# EAGLE design CameraSliderV2 (EAGLE 7.3.0)
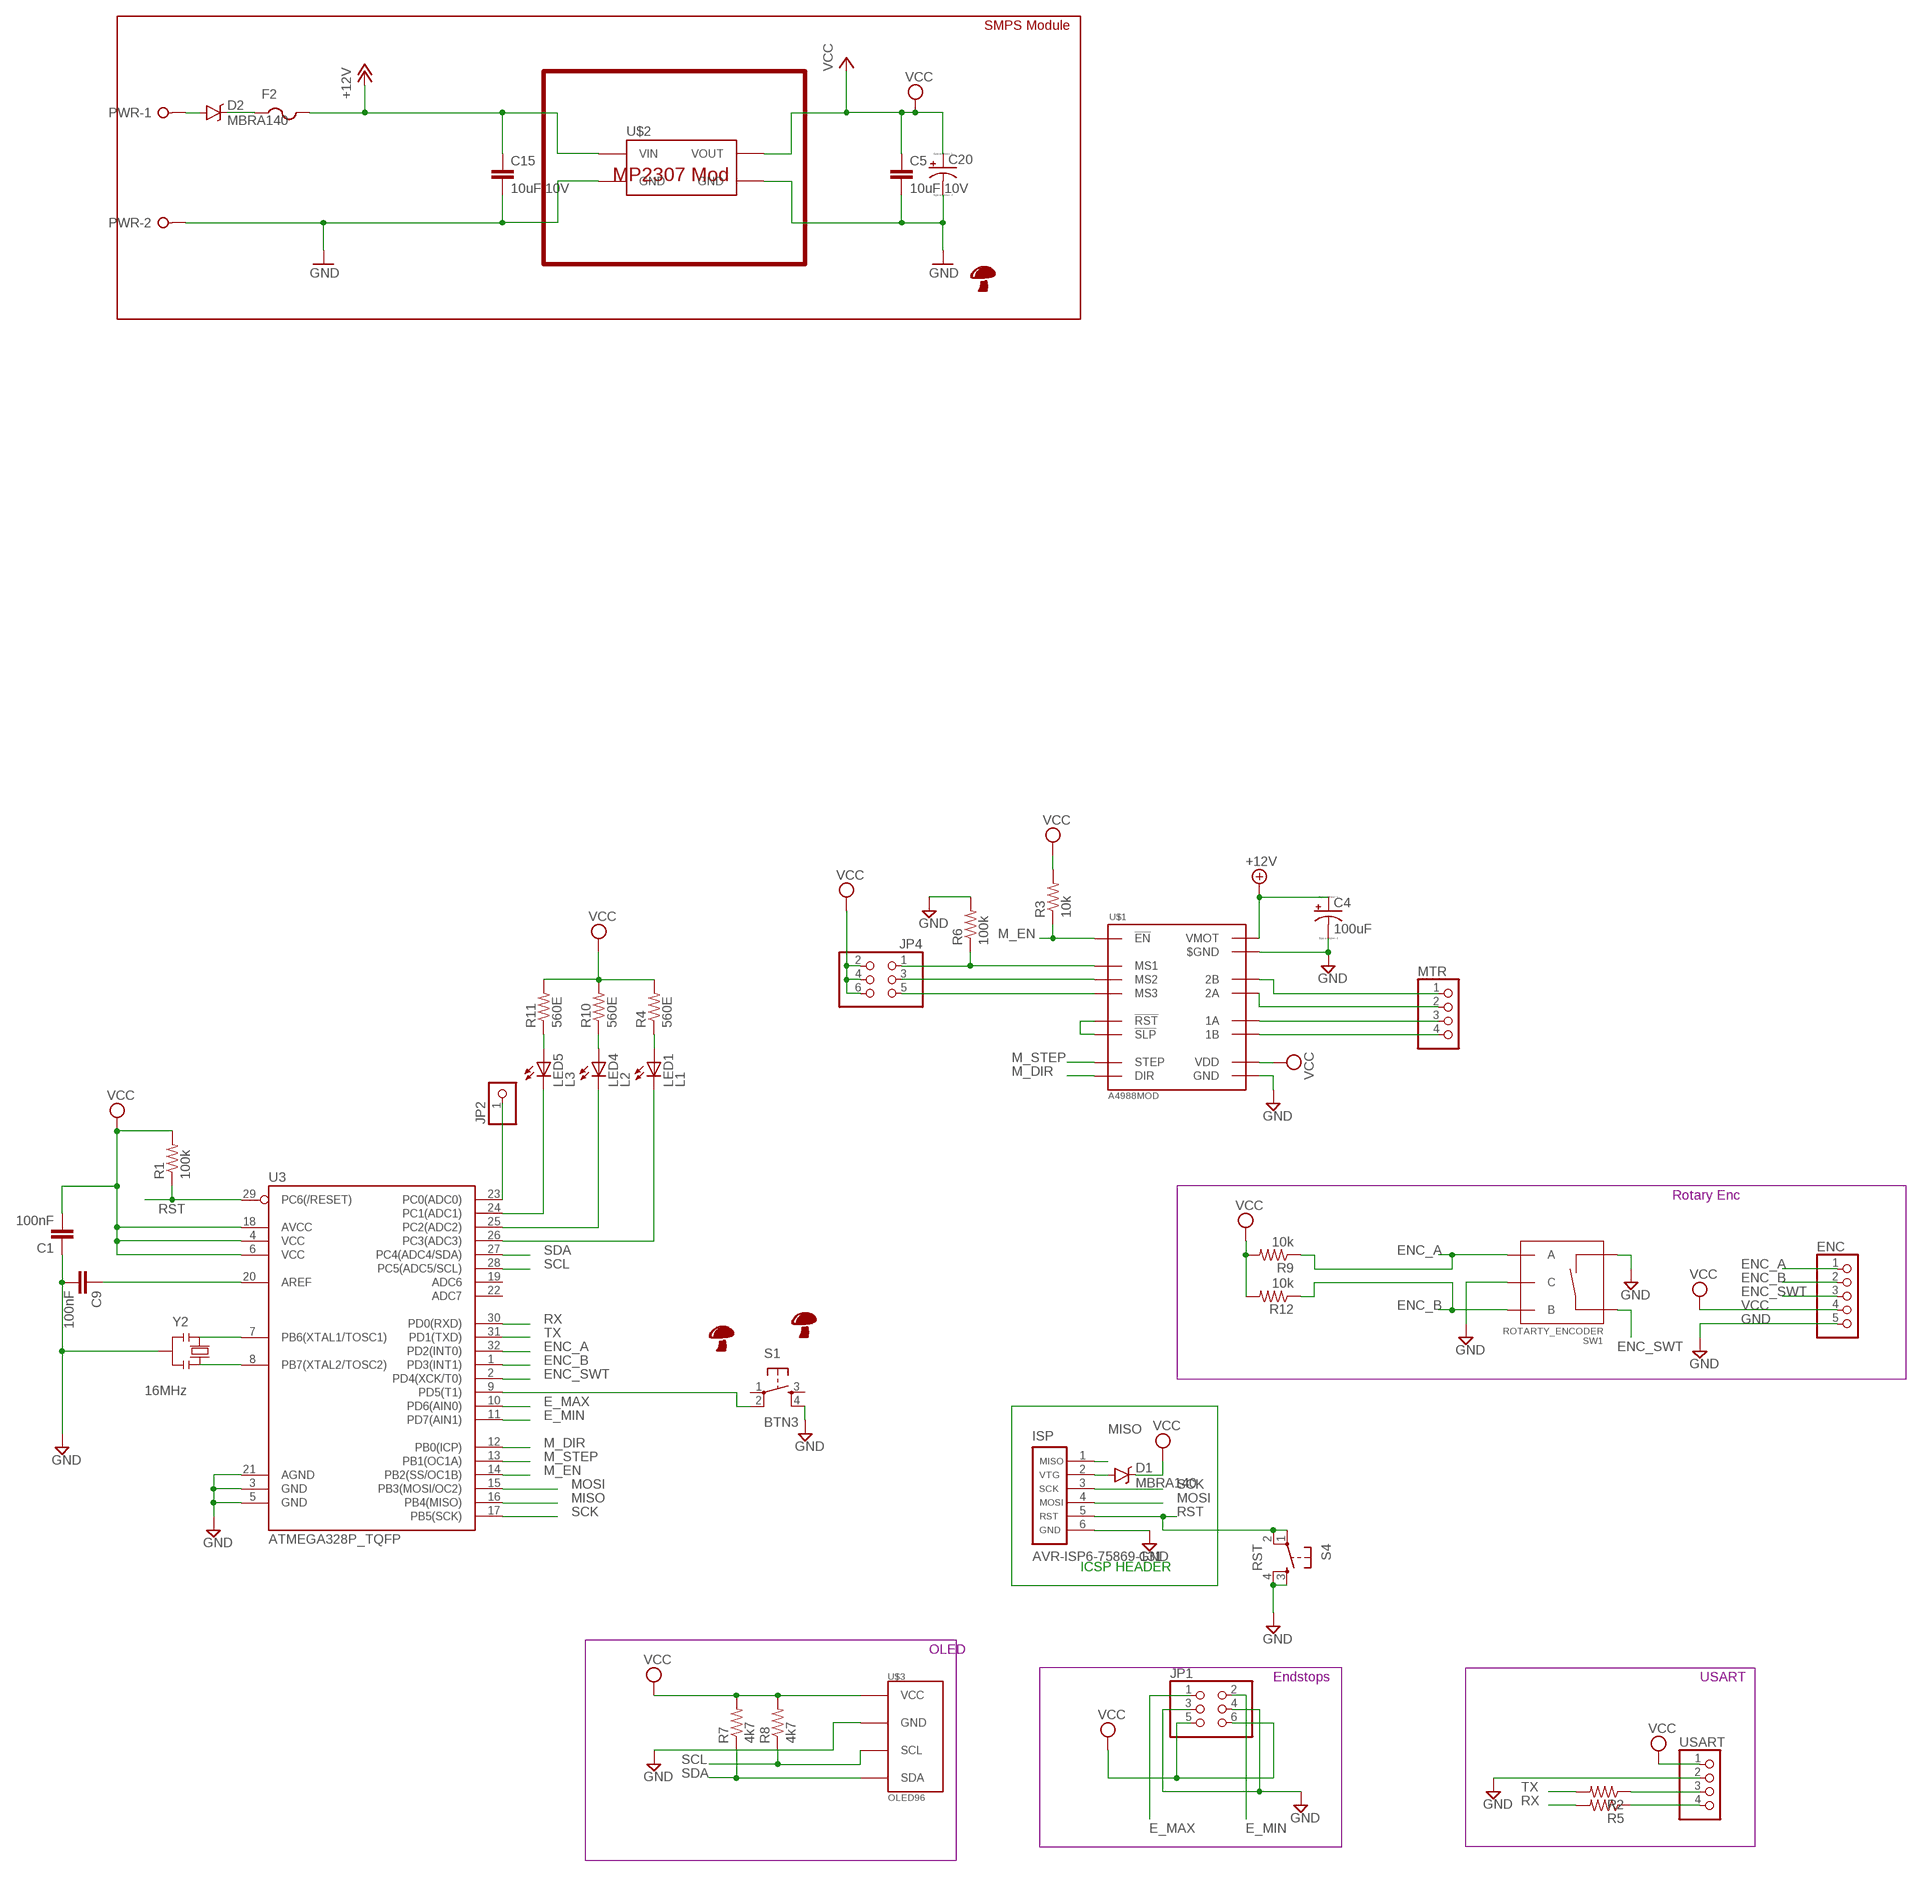
[diagram p0: schematic, sheet 1]

## Parts
C1  100nF  C-EUC0805  [C0805]
C4  100uF  CPOL-USD  [PANASONIC_D]
C5  10uF 10V  C-EUC0805  [C0805]
C9  100nF  C-EUC0805  [C0805]
C15  10uF 10V  C-EUC0805  [C0805]
C20  CPOL-USD  [PANASONIC_D]
D1  MBRA140  [SMA-DIODE]
D2  MBRA140  [SMA-DIODE]
ENC  PINHD-1X5  [1X05]
F2  PTCFUSE-1812  [1812]
ISP  AVR-ISP6-75869-131  [HDR-75869-131]
JP1  PINHD-2X3  [2X03]
JP2  PINHD-1X1  [1X01]
JP4  PINHD-2X3  [2X03]
LED1  L1  LEDCHIP-LED0805  [CHIP-LED0805]
LED4  L2  LEDCHIP-LED0805  [CHIP-LED0805]
LED5  L3  LEDCHIP-LED0805  [CHIP-LED0805]
MTR  PINHD-1X4  [1X04]
PWR  W237-02P  [W237-132]
R1  100k  R-US_M0805  [M0805]
R2  R-US_M0805  [M0805]
R3  10k  R-US_M0805  [M0805]
R4  560E  R-US_M0805  [M0805]
R5  R-US_M0805  [M0805]
R6  100k  R-US_M0805  [M0805]
R7  4k7  R-US_M0805  [M0805]
R8  4k7  R-US_M0805  [M0805]
R9  10k  R-US_M0805  [M0805]
R10  560E  R-US_M0805  [M0805]
R11  560E  R-US_M0805  [M0805]
R12  10k  R-US_M0805  [M0805]
S1  BTN3  TAC_SWITCHSMD  [TACTILE_SWITCH_SMD]
S4  RST  TAC_SWITCHSMD  [TACTILE_SWITCH_SMD]
SW1  ROTARTY_ENCODER  [ROTARY_ENC_PLAIN]
U3  ATMEGA328P_TQFP  [TQFP32-08]
U$1  A4988MOD  [A4988MOD]
U$2  MP1584_MODULE  [D-SUN_MP1584]
U$3  OLED96  [OLED96]
U$4  SHROOM10MM  [SHROOM10MM]
U$5  SHROOMTOPSILK  [SHROOM_TS]
U$15  SHROOM5MM  [SHROOM]
USART  PINHD-1X4  [1X04]
Y2  16MHz  RESONATORMU  [RESONATOR]

## Nets
+12V: C4.+ C15.1 F2.2 U$1.P$16(VMOT) U$2.P$5(VIN) U$2.P$6(VIN)
E_MAX: JP1.1 U3.10(PD6(AIN0))
E_MIN: JP1.2 U3.11(PD7(AIN1))
ENC_A: ENC.1 R9.1 SW1.A U3.32(PD2(INT0))
ENC_B: ENC.2 R12.1 SW1.B U3.1(PD3(INT1))
ENC_SWT: ENC.3 SW1.SW+ U3.2(PD4(XCK/T0))
GND: C1.1 C4.- C5.2 C9.2 C15.2 C20.- ENC.5 ISP.6 JP1.3 JP1.4 PWR.2 R6.2 S1.4 S4.3 S4.4 SW1.C SW1.SW- U3.3(GND) U3.5(GND) U3.21(AGND) U$1.P$9(GND) U$1.P$15($GND) U$2.P$1(GND) U$2.P$2(GND) U$2.P$3(GND) U$2.P$4(GND) U$3.P$2(GND) USART.2 Y2.2
M_DIR: U3.12(PB0(ICP)) U$1.P$8(DIR)
M_EN: R3.1 U3.14(PB2(SS/OC1B)) U$1.P$1(!EN)
M_STEP: U3.13(PB1(OC1A)) U$1.P$7(STEP)
MISO: ISP.1 U3.16(PB4(MISO))
MOSI: ISP.4 U3.15(PB3(MOSI/OC2))
N$1: LED1.A R4.1
N$2: D1.A ISP.2
N$3: LED5.C U3.24(PC1(ADC1))
N$4: JP4.1 R6.1 U$1.P$2(MS1)
N$5: U3.7(PB6(XTAL1/TOSC1)) Y2.1
N$6: U3.8(PB7(XTAL2/TOSC2)) Y2.3
N$7: LED4.A R10.1
N$8: LED5.A R11.1
N$9: LED4.C U3.25(PC2(ADC2))
N$10: LED1.C U3.26(PC3(ADC3))
N$11: S1.2 U3.9(PD5(T1))
N$12: MTR.2 U$1.P$13(2A)
N$13: R2.1 USART.3
N$14: R5.1 USART.4
N$15: C9.1 U3.20(AREF)
N$16: MTR.1 U$1.P$14(2B)
N$17: MTR.3 U$1.P$12(1A)
N$18: MTR.4 U$1.P$11(1B)
N$19: JP4.3 U$1.P$3(MS2)
N$20: JP4.5 U$1.P$4(MS3)
N$21: U$1.P$5(!RST) U$1.P$6(!SLP)
N$22: D2.A PWR.1
N$23: JP2.1 U3.23(PC0(ADC0))
N$32: D2.C F2.1
RST: ISP.5 R1.1 S4.1 S4.2 U3.29(PC6(/RESET))
RX: R5.2 U3.30(PD0(RXD))
SCK: ISP.3 U3.17(PB5(SCK))
SCL: R8.1 U3.28(PC5(ADC5/SCL)) U$3.P$3(SCL)
SDA: R7.1 U3.27(PC4(ADC4/SDA)) U$3.P$4(SDA)
TX: R2.2 U3.31(PD1(TXD))
VCC: C1.2 C5.1 C20.+ D1.C ENC.4 JP1.5 JP1.6 JP4.2 JP4.4 JP4.6 R1.2 R3.2 R4.2 R7.2 R8.2 R9.2 R10.2 R11.2 R12.2 U3.4(VCC) U3.6(VCC) U3.18(AVCC) U$1.P$10(VDD) U$2.P$7(VOUT) U$2.P$8(VOUT) USART.1
Unconnected: S1.1 S1.3 U3.19(ADC6) U3.22(ADC7)

## Notes on the sheet
- SMPS Module
- MP2307 Mod
- Rotary Enc
- ICSP HEADER
- OLED
- Endstops | USART

## Power pins joined to a net without a drawn wire
VCC: U$3.P$1(VCC)

## Library data of the parts
C1 C5 C9 C15 = resistor:C-EU: CAPACITOR, European symbol
C4 C20 = resistor:CPOL-US: POLARIZED CAPACITOR, American symbol
D1 D2 = SparkFun-DiscreteSemi:MBRA140: 40V, 1A Schottky rectifier SMA/DO-214AC package DIO-08053; PROD_ID: DIO-08053
ENC = pinhead:PINHD-1X5: PIN HEADER
F2 = adafruit:PTCFUSE: PTC fuses, resettable thermistors
ISP = atmel-avr:AVR-ISP6-: AVR ISP-6 Serial Programming Header
JP1 JP4 = pinhead:PINHD-2X3: PIN HEADER
JP2 = pinhead:PINHD-1X1: PIN HEADER
LED1 LED4 LED5 = led:LED: LED OSRAM: - CHIPLED LG R971, LG N971, LY N971, LG Q971, LY Q971, LO R971, LY R971 LH N974, LH R974 LS Q976, LO Q976, LY Q976 LO Q996 - Hyper CHIPLED LW Q18S LB Q993, LB Q99A, LB R99A - SideLED LS A670, LO A670, LY A670, LG A670, LP A670 LB A673, LV A673, LT A673, LW A673 LH A674 LY A675 LS A676, LA A676, LO A676, LY A676, LW A676 LS A679, LY A679, LG A679 - Hyper Micro SIDELED® LS Y876, LA Y876, LO Y876, LY Y876 LT Y87S - SmartLED LW L88C, LW L88S LB L89C, LB L89S, LG L890 LS L89K, LO L89K, LY L89K LS L896, LA L896, LO L896, LY L896 - TOPLED LS T670, LO T670, LY T670, LG T670, LP T670 LSG T670, LSP T670, LSY T670, LOP T670, LYG T670 LG T671, LOG T671, LSG T671 LB T673, LV T673, LT T673, LW T673 LH T674 LS T676, LA T676, LO T676, LY T676, LB T676, LH T676, LSB T676, LW T676 LB T67C, LV T67C, LT T67C, LS T67K, LO T67K, LY T67K, LW E67C LS E67B, LA E67B, LO E67B, LY E67B, LB E67C, LV E67C, LT E67C LW T67C LS T679, LY T679, LG T679 LS T770, LO T770, LY T770, LG T770, LP T770 LB T773, LV T773, LT T773, LW T773 LH T774 LS E675, LA E675, LY E675, LS T675 LS T776, LA T776, LO T776, LY T776, LB T776 LHGB T686 LT T68C, LB T68C - Hyper Mini TOPLED® LB M676 - Mini TOPLED Santana® LG M470 LS M47K, LO M47K, LY M47K Source: http://www.osram.convergy.de LUXEON: - LUMILED® LXK2-PW12-R00, LXK2-PW12-S00, LXK2-PW14-U00, LXK2-PW14-V00 LXK2-PM12-R00, LXK2-PM12-S00, LXK2-PM14-U00 LXK2-PE12-Q00, LXK2-PE12-R00, LXK2-PE12-S00, LXK2-PE14-T00, LXK2-PE14-U00 LXK2-PB12-K00, LXK2-PB12-L00, LXK2-PB12-M00, LXK2-PB14-N00, LXK2-PB14-P00, LXK2-PB14-Q00 LXK2-PR12-L00, LXK2-PR12-M00, LXK2-PR14-Q00, LXK2-PR14-R00 LXK2-PD12-Q00, LXK2-PD12-R00, LXK2-PD12-S00 LXK2-PH12-R00, LXK2-PH12-S00 LXK2-PL12-P00, LXK2-PL12-Q00, LXK2-PL12-R00 Source: www.luxeon.com KINGBRIGHT: KA-3528ASYC Source: www.kingbright.com
MTR USART = pinhead:PINHD-1X4: PIN HEADER
PWR = con-wago-508:W237-02P: WAGO SREW CLAMP; OC_FARNELL: unknown; OC_NEWARK: unknown
R1-R12 = resistor:R-US_: RESISTOR, American symbol
S1 S4 = SparkFun:TAC_SWITCH: Momentary Switch Button commonly used for reset or general input. Spark Fun Electronics SKU : COM-00097
SW1 = SparkFun-Electromechanical:ROTARTY_ENCODER: Simple no LED rotary encoder Example: COM-09117
U3 = SparkFun-DigitalIC:ATMEGA328P_TQFP; PROD_ID: IC-09069
U$1 = RobThePyro:A4988MOD
U$2 = RobThePyro:MP1584_MODULE: SMPS Module D-SUN MP1584 http://www.haoyuelectronics.com/Attachment/MP1584/MP1584_3.jpg
U$3 = RobThePyro:OLED96: OLED Module 0.96' 128x64 I2C
U$4 U$5 U$15 = RobThePyro:SHROOM
Y2 = SmartPrj:RESONATOR

## Board
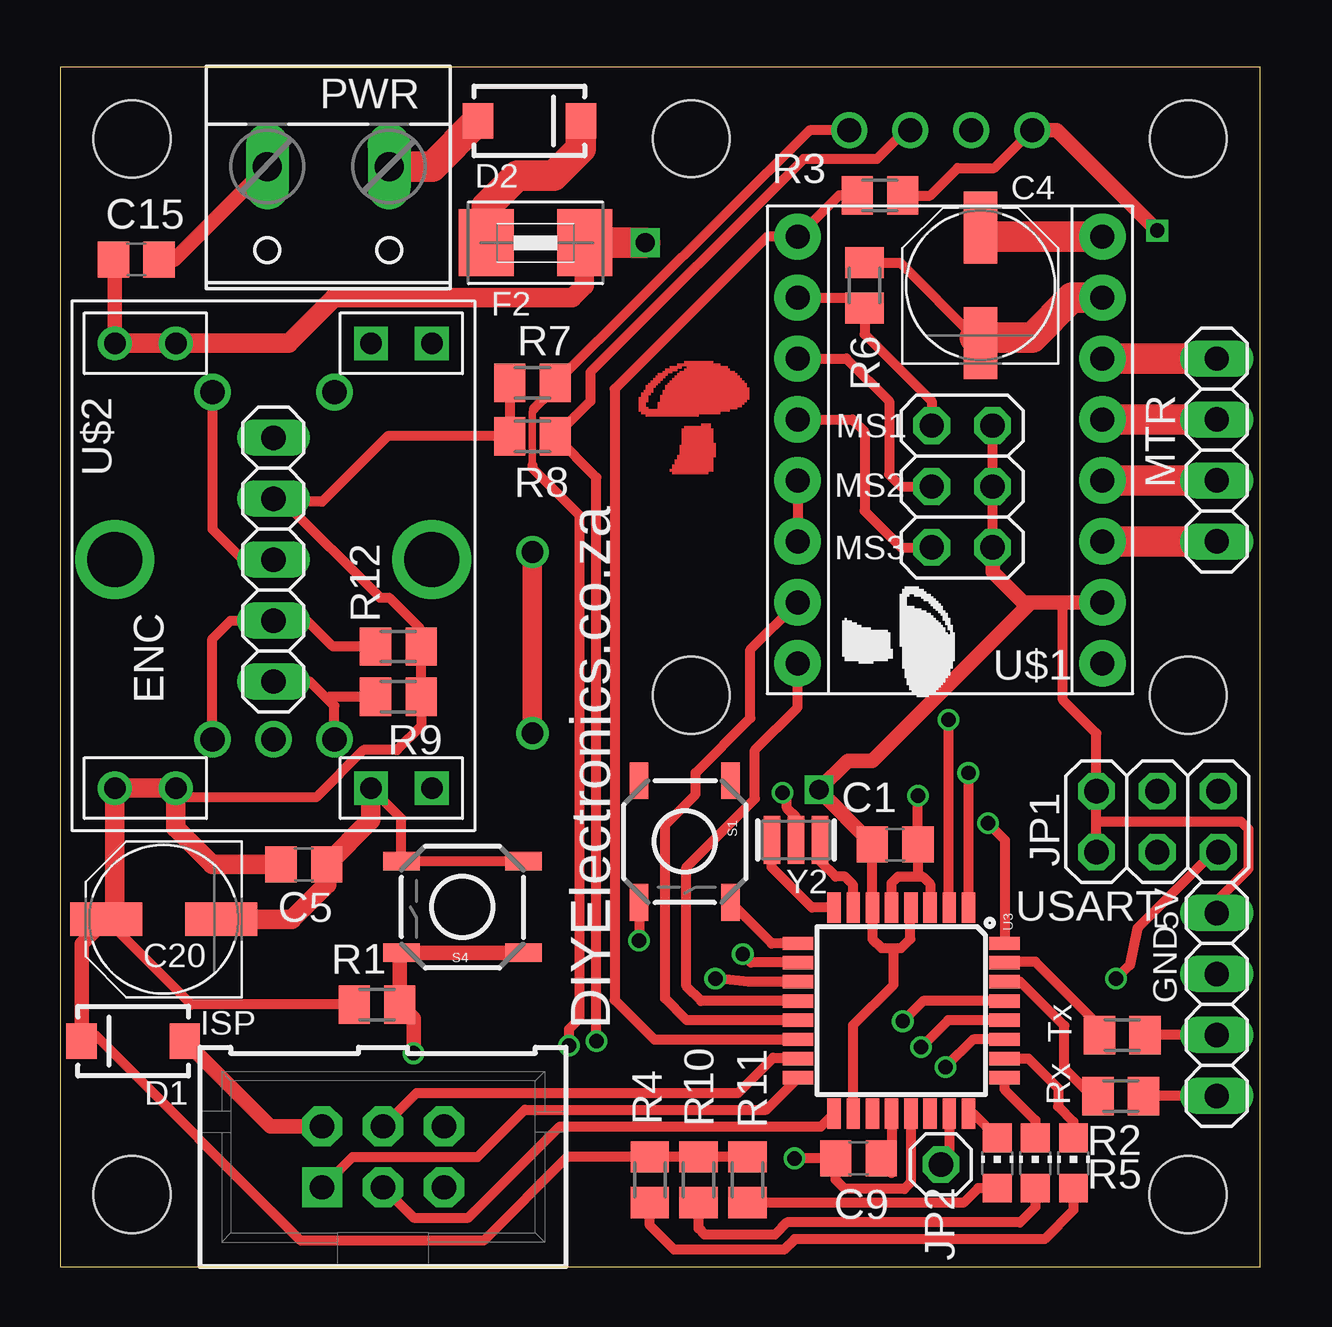
[diagram p1: board, top side]
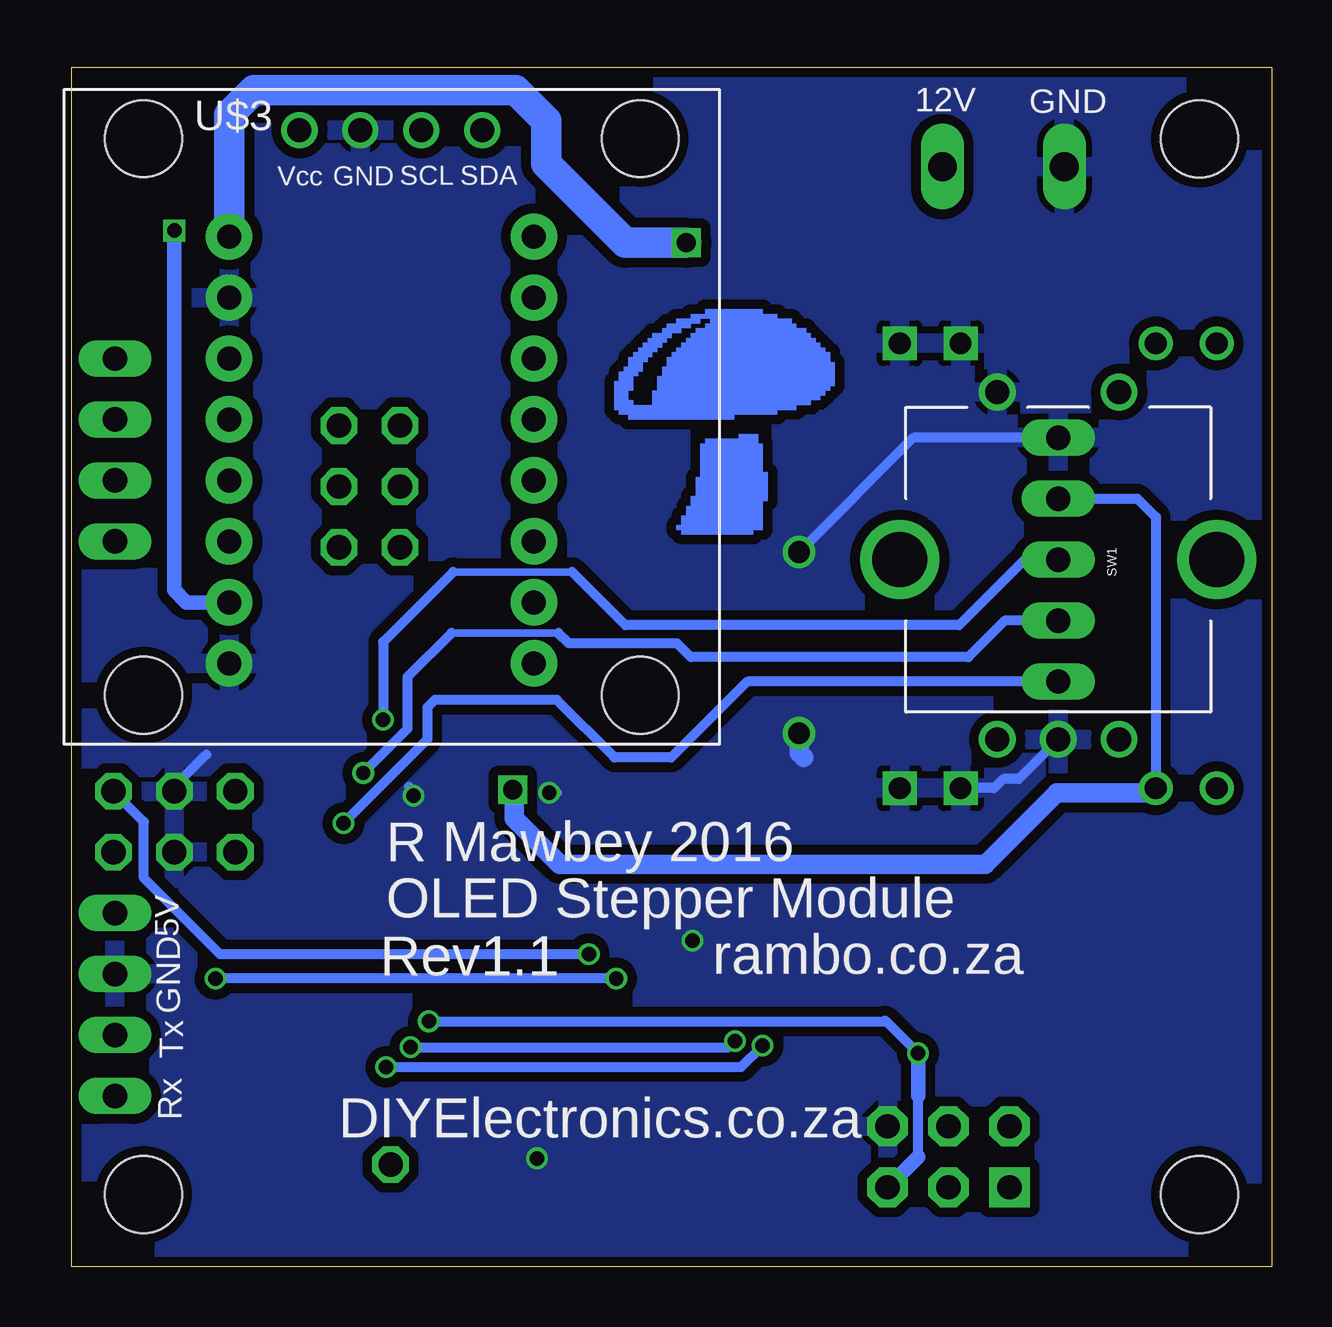
[diagram p2: board, bottom side, seen from below]

Size 50 x 50 mm. Coordinates in mm from the lower left corner, seen from the top.
Outline: 0,0 50,0 50,50 0,50 0,0
Copper layers (1*16): Top 0.035mm / dielectric 1.5mm / Bottom 0.035mm
Design rules "dirt_cheap_dirty_boards.v1": minimum track width 5mil, minimum drill 12mil, track to track 5mil, track to pad 5mil, pad to pad 5mil, via to via 5mil, smd to smd 0mil, copper to edge 10mil, drill to drill 10mil, minimum pad ring 10mil, minimum via ring 6mil, stop-mask expansion 2mil, vias tented up to drill 25mil, thermal gap 10mil
Holes 3.2 mm at 3,3 3,47 47,3

### Footprints (pad centres in the part's own frame; a part is rotated, then mirrored left to right if it is on the bottom)
C0805 = smd 1.3 x 1.5: 1 -0.95,0; 2 0.95,0
PANASONIC_D = smd 3 x 1.4: + 2.4,0; - -2.4,0
SMA-DIODE = smd 1.27 x 1.47: A -2.15,0; C 2.15,0
1X05 = drill 1.016 long: 1 -5.08,0; 2 -2.54,0; 3 0,0; 4 2.54,0; 5 5.08,0
1812 = smd 2.286 x 2.794: 1 -2.046,0; 2 2.046,0
HDR-75869-131 = drill 1.016 pad 1.676 square: 1 -2.54,-1.27 | drill 1.016 pad 1.676 octagon: 2 -2.54,1.27; 3 0,-1.27; 4 0,1.27; 5 2.54,-1.27; 6 2.54,1.27
2X03 = drill 1.016 octagon: 1 -2.54,-1.27; 2 -2.54,1.27; 3 0,-1.27; 4 0,1.27; 5 2.54,-1.27; 6 2.54,1.27
1X01 = drill 1.016 octagon: 1 0,0
CHIP-LED0805 = smd 1.2 x 1.2: A 0,-1.05; C 0,1.05
1X04 = drill 1.016 long: 1 -3.81,0; 2 -1.27,0; 3 1.27,0; 4 3.81,0
W237-132 = drill 1.194 long: 1 -2.54,-0.635; 2 2.54,-0.635
M0805 = smd 1.3 x 1.6: 1 -0.95,0; 2 0.95,0
TACTILE_SWITCH_SMD = smd 1.524 x 0.762: 1 -2.54,1.905; 2 2.54,1.905; 3 -2.54,-1.905; 4 2.54,-1.905
ROTARY_ENC_PLAIN = drill 1.016: A 7.493,-2.54; B 7.493,2.54; C 7.493,0; SW+ -6.985,2.54; SW- -6.985,-2.54 | drill 2.286: P$3 0,6.604; P$4 0,-6.604
TQFP32-08 = smd 1.27 x 0.559: 1 -4.293,2.8; 2 -4.293,2; 3 -4.293,1.2; 4 -4.293,0.4; 5 -4.293,-0.4; 6 -4.293,-1.2; 7 -4.293,-2; 8 -4.293,-2.8; 17 4.293,-2.8; 18 4.293,-2; 19 4.293,-1.2; 20 4.293,-0.4; 21 4.293,0.4; 22 4.293,1.2; 23 4.293,2; 24 4.293,2.8 | smd 0.559 x 1.27: 9 -2.8,-4.293; 10 -2,-4.293; 11 -1.2,-4.293; 12 -0.4,-4.293; 13 0.4,-4.293; 14 1.2,-4.293; 15 2,-4.293; 16 2.8,-4.293; 25 2.8,4.293; 26 2,4.293; 27 1.2,4.293; 28 0.4,4.293; 29 -0.4,4.293; 30 -1.2,4.293; 31 -2,4.293; 32 -2.8,4.293
A4988MOD = drill 1 pad 1.93: P$1 -6.35,8.89; P$2 -6.35,6.35; P$3 -6.35,3.81; P$4 -6.35,1.27; P$5 -6.35,-1.27; P$6 -6.35,-3.81; P$7 -6.35,-6.35; P$8 -6.35,-8.89; P$9 6.35,-8.89; P$10 6.35,-6.35; P$11 6.35,-3.81; P$12 6.35,-1.27; P$13 6.35,1.27; P$14 6.35,3.81; P$15 6.35,6.35; P$16 6.35,8.89
D-SUN_MP1584 = drill 0.9 square: P$1 -9.271,6.604; P$2 -9.271,4.064; P$3 9.271,6.604; P$4 9.271,4.064 | drill 0.9: P$5 -9.271,-6.604; P$6 -9.271,-4.064; P$7 9.271,-6.604; P$8 9.271,-4.064
OLED96 = drill 1: P$1 -3.85,11.95; P$2 -1.31,11.95; P$3 1.23,11.95; P$4 3.77,11.95 | hole 3.2: -10.35,-11.6; -10.35,11.6; 10.35,11.6; 10.35,-11.6
RESONATOR = smd 0.7 x 2: 1 -1,0; 2 0,0; 3 1,0

### Placement (x,y rotation side)
C1  34.8,17.59 180 top
C4  38.35,40.89 90 top
C5  10.16,16.76 0 top
C9  33.27,4.51 180 top
C15  3.17,41.97 0 top
C20  4.32,14.48 180 top
D1  3.05,9.4 180 top
D2  19.56,47.75 0 top
ENC  8.89,29.46 90 top
F2  19.81,42.67 0 top
ISP  13.46,4.57 0 top
JP1  45.72,18.54 180 top
JP2  36.7,4.25 0 top
JP4  37.59,32.51 270 top
LED1  42.23,4.32 0 top
LED4  40.64,4.32 0 top
LED5  39.05,4.32 0 top
MTR  48.2,34.04 270 top
PWR  11.18,45.21 180 top
R1  13.21,10.92 180 top
R2  44.26,9.65 180 top
R3  34.16,44.64 0 top
R4  24.57,3.62 90 top
R5  44.2,7.11 180 top
R6  33.53,40.89 90 top
R7  19.68,36.83 180 top
R8  19.68,34.61 180 top
R9  14.1,23.75 0 top
R10  26.61,3.62 90 top
R11  28.64,3.62 90 top
R12  14.1,25.84 0 top
S1  26.04,17.72 270 top
S4  16.76,14.99 180 top
SW1  8.89,29.46 270 bottom
U3  35.05,10.67 270 top
U$1  37.08,34.04 0 top
U$2  8.89,29.21 270 top
U$3  36.66,35.41 0 bottom
U$4  27.5,30.61 0 bottom
U$5  32.64,28.38 270 top
U$15  24.07,33.08 0 top
USART  48.2,10.92 270 top
Y2  30.67,17.78 180 top

### Tracks (layer width: path | path; a pad name or v marks a point on that pad's centre or on a via)
+12V  (via drill 0.8)
  Top 0.61: U$2.P$5 2.29,41.91 C15.1
  Top 0.813: U$2.P$5 U$2.P$6 9.53,38.48 11.43,40.39 21.34,40.39 21.84,40.89 21.84,42.66 F2.2
  Top 1.27: U$1.P$16 38.72,42.93 C4.+ | F2.2 v24.38,42.67
  Bottom 1.27: v24.38,42.67 26.92,42.67 30.23,45.97 30.23,47.75 31.5,49.02 42.42,49.02 43.43,48.01 U$1.P$16
E_MAX  (via drill 0.6)
  Top 0.406: U3.10 28.8,12.67 v28.45,13.02
  Bottom 0.406: v28.45,13.02 43.81,13.02 46.99,16.19 46.99,18.54 JP1.1
E_MIN  (via drill 0.6)
  Top 0.406: U3.11 28.7,11.87 v27.3,12 | JP1.2 48.07,17.27 44.9,14.1 44.58,12.57 v44.01,12
  Bottom 0.406: v27.3,12 v44.01,12
ENC_A  (via drill 0.6)
  Top 0.406: SW1.A 11.43,23.37 11.14,23.65 | 11.14,23.65 10.41,24.38 ENC.1 | R9.1 11.24,23.75 11.14,23.65 | v38.67,18.48 39.37,17.78 39.37,13.49 U3.32
  Bottom 0.406: ENC.1 21.84,24.38 25.02,21.21 27.37,21.21 29.78,23.62 34.86,23.62 35.18,23.3 35.18,21.97 v38.67,18.48
ENC_B  (via drill 0.6)
  Top 0.406: SW1.B 6.35,26.16 7.11,26.92 ENC.2 10.29,26.92 11.37,25.84 R12.1 | v37.85,20.57 U3.1
  Bottom 0.305: 29.72,26.42 34.16,26.42
  Bottom 0.406: ENC.2 11.11,26.92 12.64,25.4 24.19,25.4 24.77,25.97 29.27,25.97 29.72,26.42 | 34.16,26.42 36.01,24.57 36.01,22.42 v37.85,20.57
ENC_SWT  (via drill 0.6)
  Top 0.406: SW1.SW+ 6.35,30.73 7.62,29.46 ENC.3 | v37.02,22.8 37.02,14.99 U3.2
  Bottom 0.305: 29.15,28.96 34.1,28.96
  Bottom 0.406: ENC.3 10.29,29.46 13.02,26.73 26.92,26.73 29.15,28.96 | 34.1,28.96 37.02,26.04 v37.02,22.8
GND  (via drill 0.6, 0.9)
  Top 0.406: R6.2 35,41.84 38.12,38.73 C4.- | U3.5 34.65,15.98 34.92,16.26 35.75,16.26 | 35.75,16.26 35.94,16.26 36.26,15.94 U3.3 | 35.75,16.26 C1.1 35.75,19.36 35.75,19.37 v35.75,19.62 | U$2.P$4 14.22,18.67 S4.4 S4.3 | S1.4 v24.13,13.59 | U3.21 35.45,3.51 35.18,3.24 32.7,3.24 32.32,3.62 C9.2 | C9.2 | C9.2 v30.61,4.51 | Y2.2 30.67,18.73 30.29,19.11 30.29,19.56 v30.1,19.75
  Top 0.61: C15.2 4.76,41.97 PWR.2
  Top 0.813: U$2.P$4 12.95,18.61 C5.2 11.11,15.94 9.65,14.48 C20.- | v19.68,29.78 v19.68,22.23
  Top 1.27: 38.12,38.73 40.5,38.73 42.16,40.39 U$1.P$15
  Bottom 0.406: v35.75,19.62 35.75,19.81 35.94,20 | JP1.3 45.72,20 44.39,21.34 | v24.13,13.59 24.13,13.34 | SW1.C 10.54,20.32 11.18,20.32 11.56,19.94 U$2.P$4 | v30.1,19.75 29.78,19.75 | ENC.5 14.92,34.54 v19.68,29.78
  Bottom 0.813: v19.68,22.23 19.68,21.4 19.49,21.21
  pour Bottom (isolate 0.406): 0,0 0,50 50,50 50,0
M_DIR
  Top 0.406: U3.12 26.71,11.07 26.1,11.68 26.1,16.64 28.96,19.49 28.96,21.53 30.73,23.3 U$1.P$8
M_EN
  Top 0.406: U3.14 24.77,9.46 23.11,11.11 23.11,36.58 29.46,42.93 U$1.P$1 32.45,44.64 R3.1
M_STEP
  Top 0.406: U3.13 26.12,10.27 25.21,11.18 25.21,18.41 26.48,19.68 26.48,20.57 28.77,22.86 28.77,25.72 U$1.P$7
MISO
  Top 0.406: ISP.1 12.19,4.57 17.4,4.57 19.37,6.54 29.43,6.54 U3.16
MOSI
  Top 0.406: 30.73,8.64 U3.15 30.73,8.7 29.72,8.7 28.26,7.24 14.86,7.24 ISP.4
N$1
  Top 0.406: LED1.A 42.23,2.35 41.02,1.14 30.61,1.14 30.16,0.7 25.59,0.7 24.57,1.71 R4.1
N$2
  Top 0.61: ISP.2 8.75,5.84 D1.A
N$3
  Top 0.406: U3.24 38.05,6.38 LED5.C
N$4
  Top 0.406: U$1.P$2 33.09,40.39 | JP4.1 36.32,36.07 33.53,38.86 33.53,40.39 33.09,40.39 | 33.09,40.39 R6.1
N$5
  Top 0.406: U3.7 33.05,15.91 32.7,16.26 32.32,16.26 31.69,16.89 31.69,17.76 Y2.1
N$6
  Top 0.406: U3.8 31.33,14.96 29.65,16.64 29.65,17.76 Y2.3
N$7
  Top 0.406: LED4.A 40.64,2.48 40.01,1.84 30.29,1.84 29.78,1.33 26.86,1.33 26.61,1.59 R10.1
N$8
  Top 0.406: LED5.A 38.26,3.27 37.66,2.67 R11.1
N$9
  Top 0.406: U3.25 39.34,7.39 40.64,6.1 LED4.C
N$10
  Top 0.406: U3.26 40.35,8.67 41.59,7.43 41.59,6.67 42.23,6.03 LED1.C
N$11
  Top 0.406: U3.9 29.65,13.47 S1.2
N$12
  Top 1.27: U$1.P$13 MTR.2
N$13
  Top 0.406: USART.3 R2.1
N$14
  Top 0.406: USART.4 R5.1
N$15
  Top 0.406: U3.20 34.65,3.89 C9.1
N$16
  Top 1.27: U$1.P$14 MTR.1
N$17
  Top 1.27: U$1.P$12 MTR.3
N$18
  Top 1.27: U$1.P$11 MTR.4
N$19
  Top 0.406: U$1.P$3 32.77,37.85 34.54,36.07 34.54,33.02 35.05,32.51 JP4.3
N$20
  Top 0.406: U$1.P$4 33.02,35.31 33.53,34.8 33.53,31.5 35.05,29.97 JP4.5
N$21
  Top 0.406: U$1.P$5 U$1.P$6
N$22
  Top 1.27: PWR.1 15.5,45.85 D2.A
N$23
  Top 0.406: U3.23 37.05,4.6 JP2.1
N$32
  Top 1.27: D2.C 21.71,46.6 20.57,45.47 19.05,45.47 17.78,44.2 17.78,42.69 F2.1
RST  (via drill 0.6)
  Top 0.406: U3.29 35.96,11.07 v35.12,10.22
  Top 0.61: v14.73,8.89 14.73,10.35 R1.1 14.16,13.02 S4.2 S4.1
  Bottom 0.406: 14.73,4.57 14.73,7.11 | v14.73,8.89 16.1,10.26 16.13,10.22 v35.12,10.22
  Bottom 0.61: ISP.5 14.73,4.57 | 14.73,7.11 v14.73,8.89
RX
  Top 0.406: R5.2 42.99,7.11 41.85,8.26 41.85,10.03 40.01,11.87 U3.30
SCK
  Top 0.406: ISP.3 14.73,2.03 17.02,2.03 20.83,5.84 31.72,5.84 U3.17 32.23,6.35
SCL  (via drill 0.6)
  Top 0.406: U3.28 37,10.27 v35.88,9.14 | v22.35,9.4 22.35,32.89 R8.1 22.1,36.07 22.1,37.27 30.99,46.16 34.04,46.16 35.24,47.36 U$3.P$3
  Bottom 0.406: v35.88,9.14 22.61,9.14 v22.35,9.4
SDA  (via drill 0.6)
  Top 0.305: 19.75,35.75 19.75,35.69 19.68,35.62 19.68,33.4
  Top 0.406: U3.27 38.04,9.47 v36.89,8.32 | U$3.P$4 31.23,47.36 R7.1 20.38,36.52 20.38,36.39 19.75,35.75 | 19.68,33.4 19.68,33.27 21.65,31.3 21.65,10.35 21.21,9.91 v21.21,9.21
  Bottom 0.406: v36.89,8.32 22.1,8.32 v21.21,9.21
TX
  Top 0.406: R2.2 43.31,10.03 40.64,12.7 39.38,12.7 U3.31
VCC  (via drill 0.6, 0.8)
  Top 0.406: JP4.6 JP4.4 JP4.2 | R1.2 5.47,10.92 C20.+ | U3.18 33.05,10.06 34.73,11.75 34.73,13.27 | U3.6 | 34.73,13.27 35.05,13.27 35.43,13.65 35.43,14.94 U3.4 | U3.6 33.85,13.65 34.23,13.27 34.73,13.27 | U3.6 C1.2 | JP1.6 43.18,18.48 | 43.18,18.48 JP1.5 43.18,22.23 41.78,23.62 41.78,27.5 41.59,27.69 | USART.1 48.26,15.3 49.53,16.57 49.53,18.22 49.21,18.54 43.24,18.54 43.18,18.48 | R12.2 R9.2 15.05,22.54 14.03,21.53 12.64,21.53 10.67,19.56 5.02,19.56 4.83,19.75 | 14.99,25.91 14.99,26.61 13.72,27.88 13.34,27.88 9.21,32 ENC.4 9.02,31.88 10.92,31.88 13.65,34.61 R8.2 R7.2 | 14.99,25.91 14.99,25.84 15.05,25.78 15.05,25.72 14.8,25.97 14.92,25.97 14.99,25.91 | R3.2 36.26,44.64 37.4,45.78 38.92,45.78 U$3.P$1 | R11.2 R10.2 R4.2 21.14,4.57 17.65,1.08 10.03,1.08 1.46,9.65 1.15,9.65 D1.C
  Top 0.61: U$1.P$10 41.59,27.69 40.45,27.69 | 40.45,27.69 40.13,27.69 38.86,28.96 JP4.6 | U$3.P$1 41.54,47.36 v45.72,43.18 | D1.C 0.9,13.46 C20.+ | C1.2 v31.62,19.88 32.83,21.08 33.85,21.08 40.45,27.69
  Top 0.813: C20.+ 2.29,14.85 U$2.P$7 U$2.P$8 4.83,19.75 4.83,18.29 6.35,16.76 C5.1
  Bottom 0.406: ENC.4 5.59,32 4.83,31.24 U$2.P$8
  Bottom 0.61: v45.72,43.18 45.72,28.19 45.21,27.69 U$1.P$10
  Bottom 0.813: U$2.P$8 5.02,19.75 8.95,19.75 11.94,16.76 29.65,16.76 31.56,18.67 31.56,19.81 v31.62,19.88

### Text on the board
tNames: MS1 | MS2 | MS3 | 5V | GND | DIYElectronics.co.za | Tx | Rx
bNames: GND | 12V | R Mawbey 2016 | OLED Stepper Module | 5V | GND | rambo.co.za | Rev1.1 | Tx | Rx | DIYElectronics.co.za